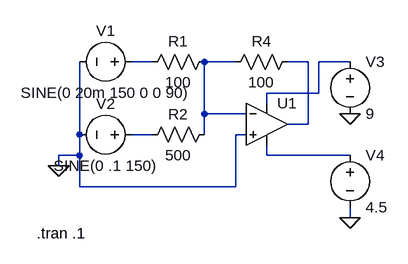
[diagram p0: schematic summing_circuit.asc]
summing_circuit.asc, the LTspice schematic file:
Version 4
SHEET 1 880 680
WIRE 16 96 -16 96
WIRE 144 96 96 96
WIRE 256 96 224 96
WIRE 320 96 272 96
WIRE 272 144 272 96
WIRE 272 144 192 144
WIRE 192 160 192 144
WIRE 96 176 96 96
WIRE 160 176 96 176
WIRE 256 192 256 96
WIRE 256 192 224 192
WIRE -96 208 -96 96
WIRE 16 208 -16 208
WIRE 96 208 96 176
WIRE 160 208 144 208
WIRE -96 240 -96 208
WIRE -96 240 -128 240
WIRE 192 240 192 224
WIRE 320 240 192 240
WIRE -128 256 -128 240
WIRE -96 288 -96 240
WIRE 144 288 144 208
WIRE 144 288 -96 288
WIRE 320 336 320 320
FLAG -128 256 0
FLAG 320 176 0
FLAG 320 336 0
SYMBOL Opamps\\UniversalOpamp2 192 192 R0
SYMATTR InstName U1
SYMBOL voltage 0 96 R90
WINDOW 0 -32 56 VBottom 2
WINDOW 3 32 56 VTop 2
WINDOW 123 0 0 Left 2
WINDOW 39 0 0 Left 2
SYMATTR InstName V1
SYMATTR Value SINE(0 20m 150 0 0 90)
SYMBOL voltage 0 208 R90
WINDOW 0 -32 56 VBottom 2
WINDOW 3 32 56 VTop 2
WINDOW 123 0 0 Left 2
WINDOW 39 0 0 Left 2
SYMATTR InstName V2
SYMATTR Value SINE(0 .1 150)
SYMBOL res 0 112 R270
WINDOW 0 32 56 VTop 2
WINDOW 3 0 56 VBottom 2
SYMATTR InstName R1
SYMATTR Value 100
SYMBOL res 0 224 R270
WINDOW 0 32 56 VTop 2
WINDOW 3 0 56 VBottom 2
SYMATTR InstName R2
SYMATTR Value 500
SYMBOL res 128 112 R270
WINDOW 0 32 56 VTop 2
WINDOW 3 0 56 VBottom 2
SYMATTR InstName R4
SYMATTR Value 100
SYMBOL voltage 320 80 R0
WINDOW 123 0 0 Left 2
WINDOW 39 0 0 Left 2
SYMATTR InstName V3
SYMATTR Value 9
SYMBOL voltage 320 224 R0
WINDOW 123 0 0 Left 2
WINDOW 39 0 0 Left 2
SYMATTR InstName V4
SYMATTR Value 4.5
TEXT -162 360 Left 2 !.tran .1

The netlist it stands for:
* summing_circuit.asc
XU1 0 N002 N004 N006 N003 level.2 Avol=1Meg GBW=10Meg Slew=10Meg ilimit=25m rail=0 Vos=0 phimargin=45 en=0 enk=0 in=0 ink=0 Rin=500Meg  ; pins IN+ IN- V+ V- OUT
V1 N001 0 SINE(0 20m 150 0 0 90)
V2 N005 0 SINE(0 .1 150)
R1 N001 N002 100
R2 N005 N002 500
R4 N002 N003 100
V3 N004 0 9
V4 N006 0 4.5
.tran .1
.lib UniversalOpamps2.sub
.backanno
.end